# Altium schematic sheet 4_sensores.SchDoc: Teseu - Sensores
size A4; DocumentNumber: 5; Revision: 0.1; SheetNumber: 5; SheetTotal: 6
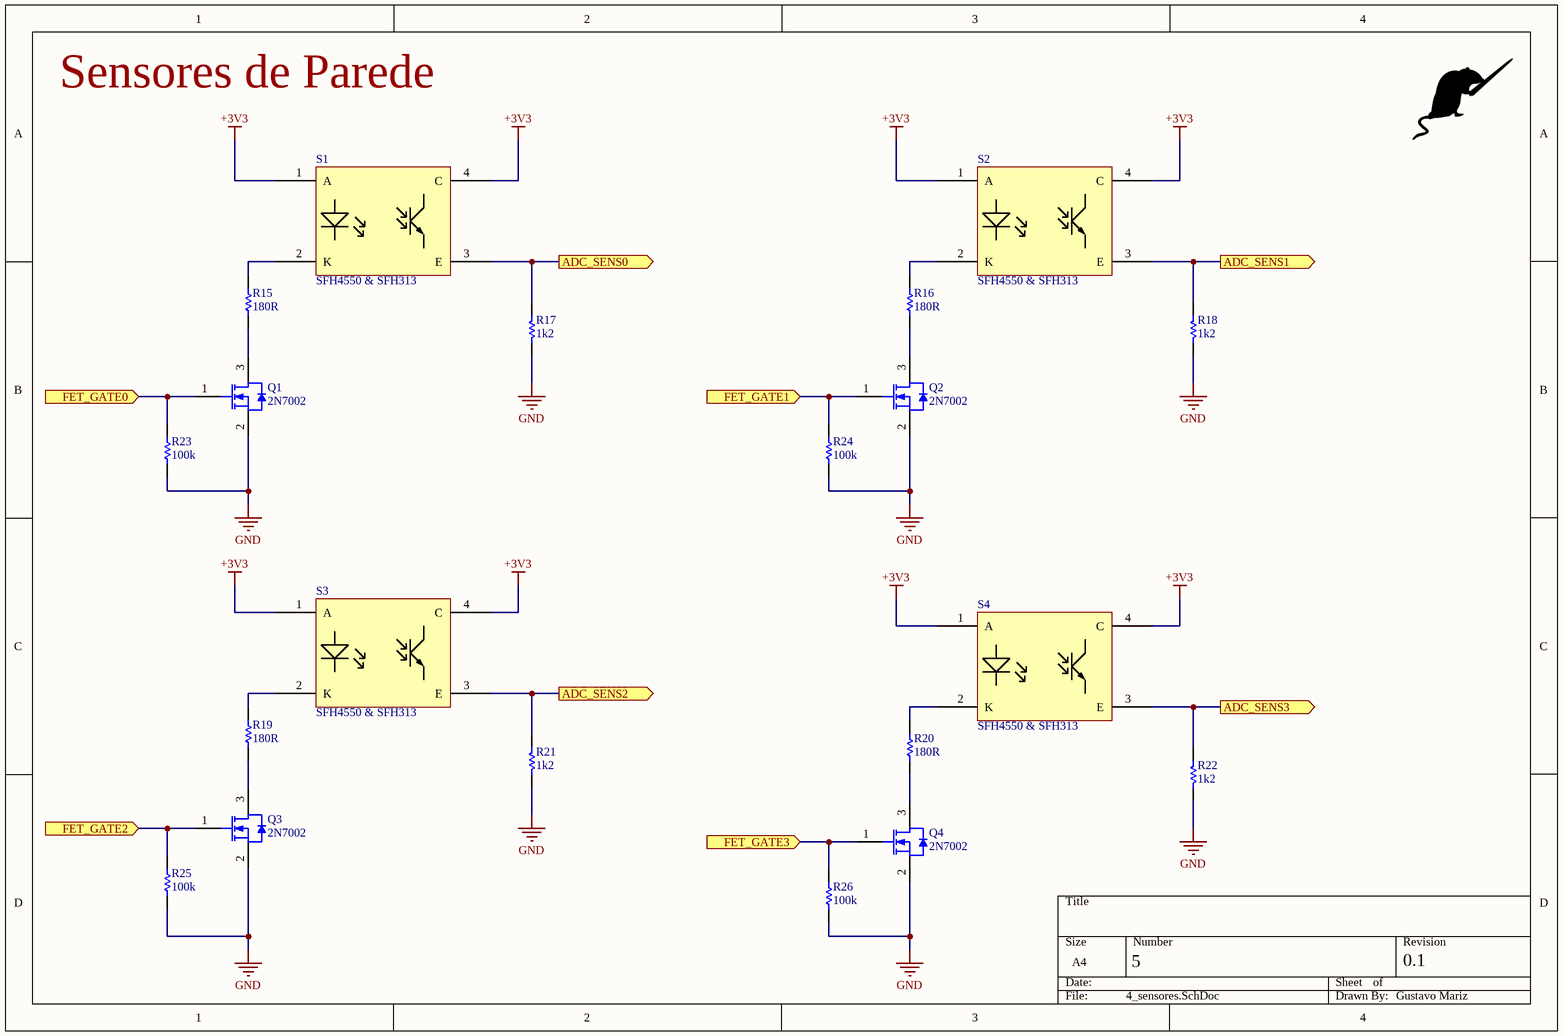
[diagram p0: 4_sensores.SchDoc]

## Parts
Q1  2N7002  [STM-SOT-23-3_V]
Q2  2N7002  [STM-SOT-23-3_V]
Q3  2N7002  [STM-SOT-23-3_V]
Q4  2N7002  [STM-SOT-23-3_V]
R15  value 180R  [RES 0805]  (hidden comment: RESISTOR)
R16  value 180R  [RES 0805]  (hidden comment: RESISTOR)
R17  value 1k2  [RES 0805]  (hidden comment: RESISTOR)
R18  value 1k2  [RES 0805]  (hidden comment: RESISTOR)
R19  value 180R  [RES 0805]  (hidden comment: RESISTOR)
R20  value 180R  [RES 0805]  (hidden comment: RESISTOR)
R21  value 1k2  [RES 0805]  (hidden comment: RESISTOR)
R22  value 1k2  [RES 0805]  (hidden comment: RESISTOR)
R23  value 100k  [RES 0603]  (hidden comment: RESISTOR)
R24  value 100k  [RES 0603]  (hidden comment: RESISTOR)
R25  value 100k  [RES 0603]  (hidden comment: RESISTOR)
R26  value 100k  [RES 0603]  (hidden comment: RESISTOR)
S1  SFH4550 & SFH313  [umouse-sensor-fp]
S2  SFH4550 & SFH313  [umouse-sensor-fp]
S3  SFH4550 & SFH313  [umouse-sensor-fp]
S4  SFH4550 & SFH313  [umouse-sensor-fp]

## Ports
ADC_SENS0 (out, see 1_micro[2B]), ADC_SENS1 (out, see 1_micro[2A]), ADC_SENS2 (out, see 1_micro[2A]), ADC_SENS3 (out, see 1_micro[2B]), FET_GATE0 (in, see 1_micro[2B]), FET_GATE1 (in, see 1_micro[2A]), FET_GATE2 (in, see 1_micro[2B]), FET_GATE3 (in, see 1_micro[2C])

## Nets
+3V3: S1.1(A) S1.4(C) S2.1(A) S2.4(C) S3.1(A) S3.4(C) S4.1(A) S4.4(C)
GND: Q1.2(S) Q2.2(S) Q3.2(S) Q4.2(S) R17.1 R18.1 R21.1 R22.1 R23.1 R24.1 R25.1 R26.1
ADC_SENS0: R17.2 S1.3(E) ; port ADC_SENS0
ADC_SENS1: R18.2 S2.3(E) ; port ADC_SENS1
ADC_SENS2: R21.2 S3.3(E) ; port ADC_SENS2
ADC_SENS3: R22.2 S4.3(E) ; port ADC_SENS3
FET_GATE0: Q1.1(G) R23.2 ; port FET_GATE0
FET_GATE1: Q2.1(G) R24.2 ; port FET_GATE1
FET_GATE2: Q3.1(G) R25.2 ; port FET_GATE2
FET_GATE3: Q4.1(G) R26.2 ; port FET_GATE3
NetQ1_3: Q1.3(D) R15.1
NetQ2_3: Q2.3(D) R16.1
NetQ3_3: Q3.3(D) R19.1
NetQ4_3: Q4.3(D) R20.1
NetR15_2: R15.2 S1.2(K)
NetR16_2: R16.2 S2.2(K)
NetR19_2: R19.2 S3.2(K)
NetR20_2: R20.2 S4.2(K)

## Notes on the sheet
- Sensores de Parede
- Gustavo Mariz

## Library data of the parts
Q1-Q4 = CMP-0434-00001-1: N-channel 60 V, 1.8 Ohm, 0.35 A STripFET(TM) II Power MOSFET, SOT23; Manufacturer: STMicroelectronics; PartNumber: 2N7002; ComponentLink2Description: Datasheet; ComponentLink2URL: http://www.st.com/st-web-ui/static/active/en/resource/technical/document/datasheet/CD00005134.pdf; ComponentLink1Description: Manufacturer URL; ComponentLink1URL: http://www.st.com/; DatasheetVersion: Rev. 9, 11/2008; PackageReference: SOT-23; Mounting Technology: Surface Mount; PackageDescription: 3-Pin SOT23, 3.016 x 2.8 mm Body, 0.95 mm Pitch